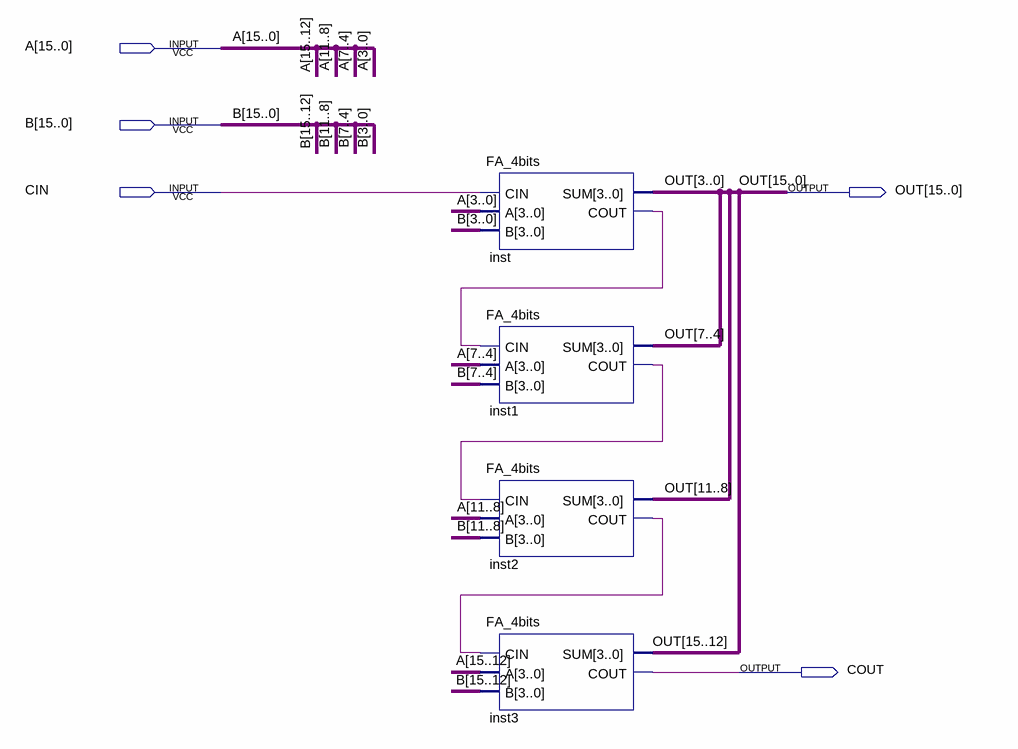
[diagram p0: schematic sheet]
// Quartus schematic FA_16bits.bdf as structural Verilog: 4 symbols, 5 pins
module FA_16bits (
  input  [15:0] A,
  input  [15:0] B,
  input  CIN,
  output [15:0] OUT,
  output COUT
);

  wire inst1_cout, inst2_cout, inst_cout;

  FA_4bits inst (.CIN(CIN), .A(A[3:0]), .B(B[3:0]), .SUM(OUT[3:0]), .COUT(inst_cout));
  FA_4bits inst1 (.CIN(inst_cout), .A(A[7:4]), .B(B[7:4]), .SUM(OUT[7:4]), .COUT(inst1_cout));
  FA_4bits inst2 (.CIN(inst1_cout), .A(A[11:8]), .B(B[11:8]), .SUM(OUT[11:8]), .COUT(inst2_cout));
  FA_4bits inst3 (.CIN(inst2_cout), .A(A[15:12]), .B(B[15:12]), .SUM(OUT[15:12]), .COUT(COUT));
endmodule
